# EAGLE schematic r3_sch (EAGLE 9.5.2)
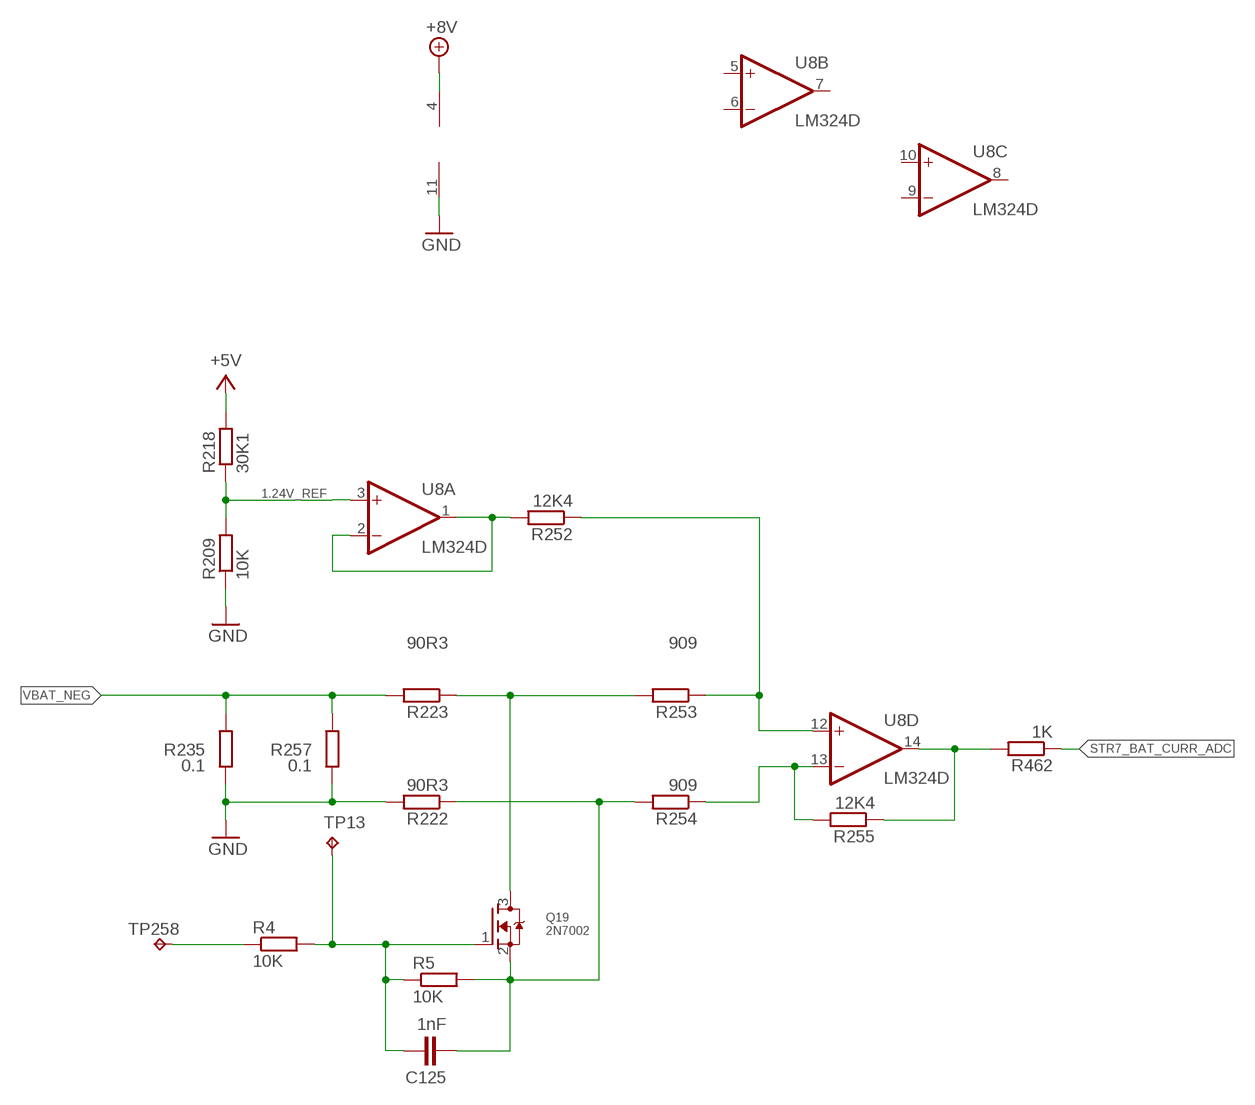
[diagram p0: schematic, sheet 1]

## Parts
C125  1nF  C-EUC0603  [C0603]
Q19  2N7002  MOSFET-NREFLOW  [SOT23]
R4  10K  R-EU_R0603  [R0603]
R5  10K  R-EU_R0603  [R0603]
R209  10K  R-EU_R0603  [R0603]
R218  30K1  R-EU_R0603  [R0603]
R222  90R3  R-EU_R0603  [R0603]
R223  90R3  R-EU_R0603  [R0603]
R235  0.1  R-EU_R1206  [R1206]
R252  12K4  R-EU_R0603  [R0603]
R253  909  R-EU_R0603  [R0603]
R254  909  R-EU_R0603  [R0603]
R255  12K4  R-EU_R0603  [R0603]
R257  0.1  R-EU_R1206  [R1206]
R462  1K  R-EU_R0603  [R0603]
TP13  TPB1,27  [B1,27]
TP258  TPB1,27  [B1,27]
U8  LM324D  [SO14]

## Nets
1.24V_REF: R209.2 R218.1 U8.3(A:+IN)
+5V: R218.2
+8V: U8.4(P:V+)
GND: R209.1 R222.2 R235.2 R257.2 U8.11(P:V-)
N$2: R252.2 U8.1(A:OUT) U8.2(A:-IN)
N$4: R252.1 R253.1 U8.12(D:+IN)
N$5: R254.1 R255.2 U8.13(D:-IN)
N$6: C125.1 Q19.1(G) R4.2 R5.1 TP13.TP
N$7: R4.1 TP258.TP
N$8: R255.1 R462.2 U8.14(D:OUT)
N$9: Q19.3(D) R223.1 R253.2
N$10: C125.2 Q19.2(S) R5.2 R222.1 R254.2
STR7_BAT_CURR_ADC: R462.1
VBAT_NEG: R223.2 R235.1 R257.1
Unconnected: U8.5(B:+IN) U8.6(B:-IN) U8.7(B:OUT) U8.8(C:OUT) U8.9(C:-IN) U8.10(C:+IN)

## Library data of the parts
C125 = rcl:C-EU: CAPACITOR, European symbol
Q19 = adafruit:MOSFET-N: N-Channel Mosfet 2N7002E - 60V 260mA SOT23 [Digikey: 2N7002ET1GOSTR-ND] - REEL BSH103 - 30V 850mA SOT23 [Digikey: 568-5013-1-ND]
R4 R5 R209 R218 R222 R223 R252-R255 R462 = resistor:R-EU_: RESISTOR, European symbol
R235 R257 = rcl:R-EU_: RESISTOR, European symbol
TP13 TP258 = testpad:TP: Test pad
U8 = linear:LM324: OP AMP